# EAGLE schematic Sensor Board B (EAGLE 8.3.2)
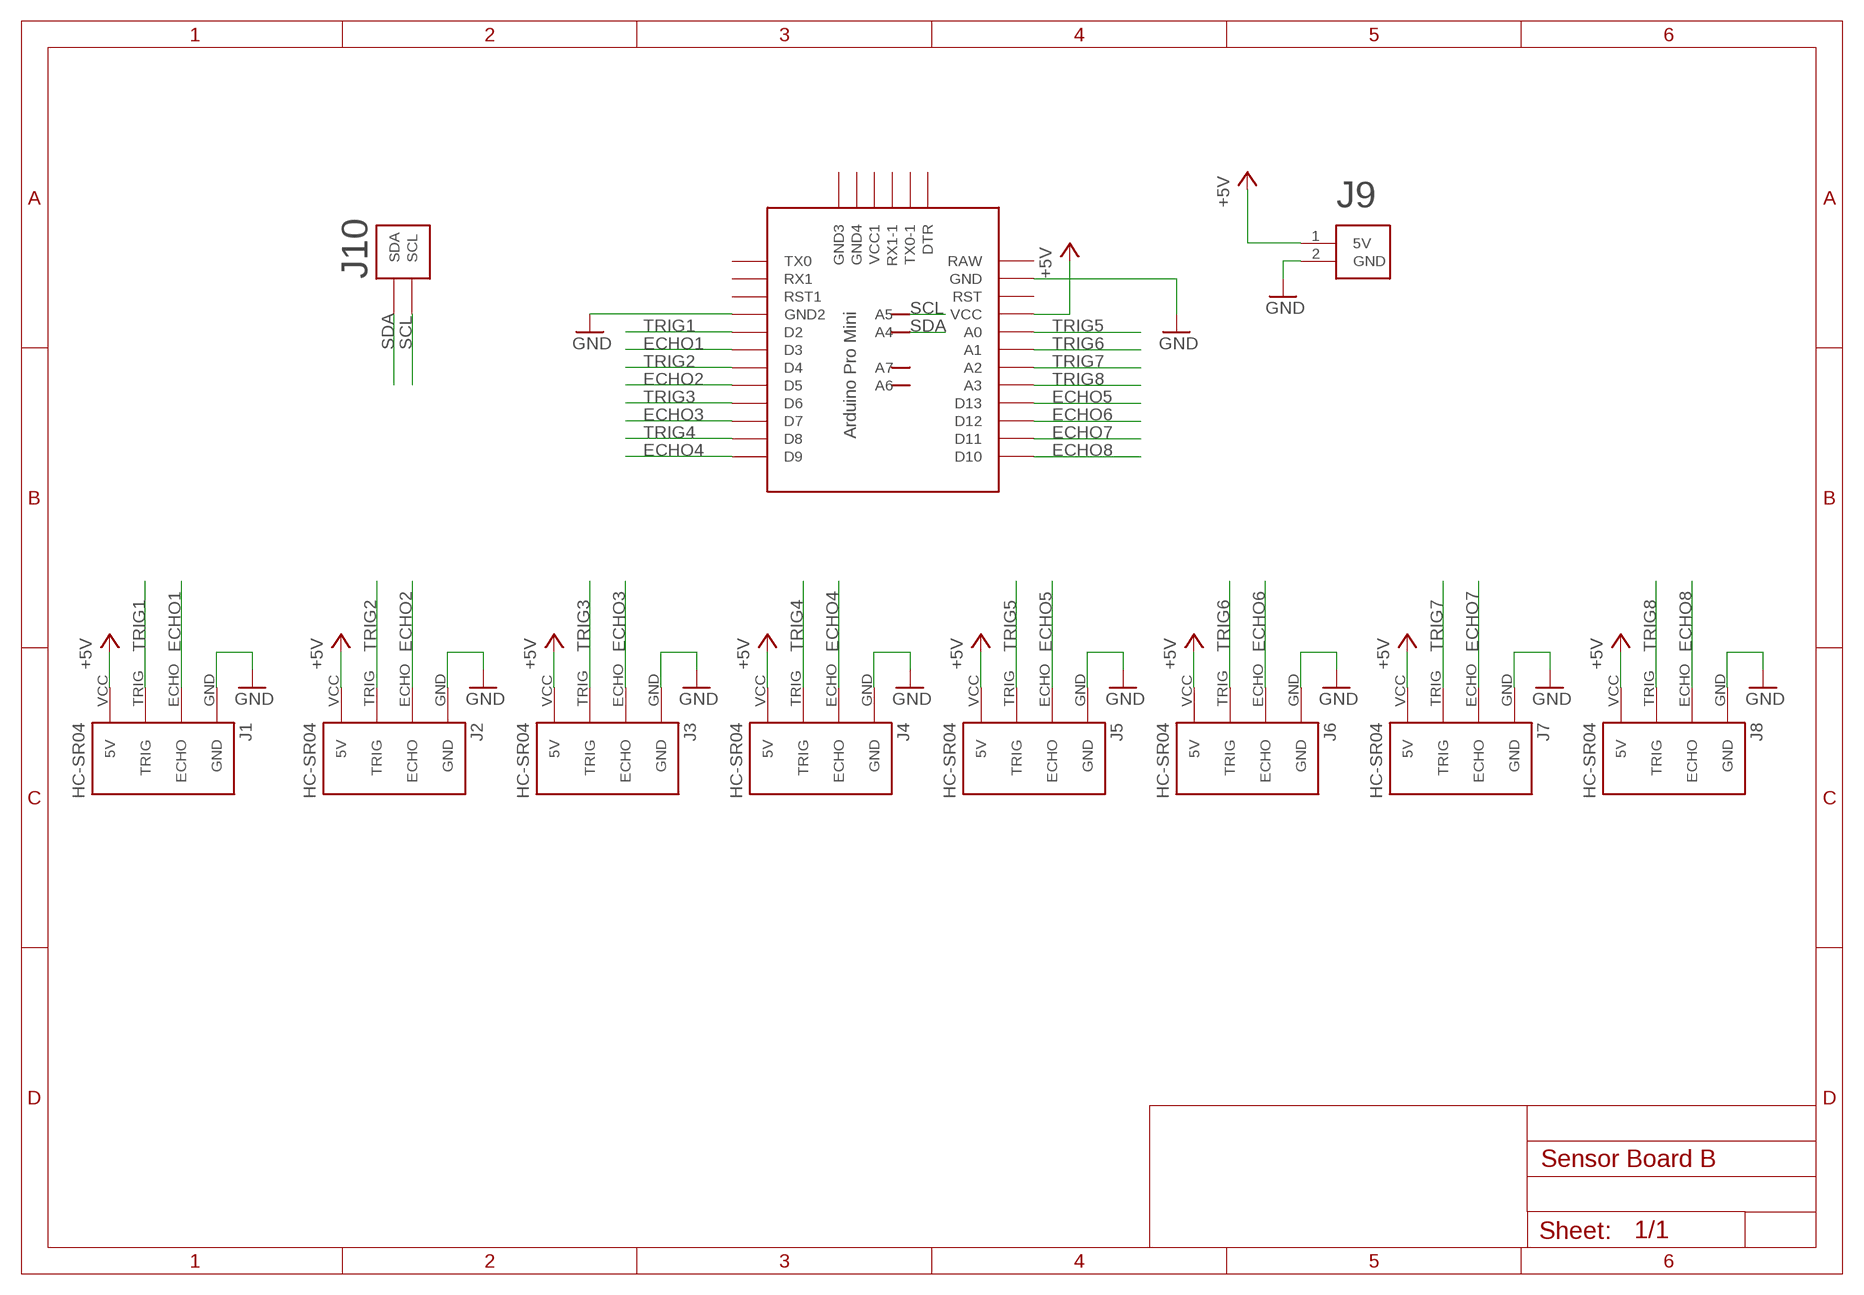
[diagram p0: schematic, sheet 1]

## Parts
J1  HC-SR04  [HC-SR04_FOOTPRINT]
J2  HC-SR04  [HC-SR04_FOOTPRINT]
J3  HC-SR04  [HC-SR04_FOOTPRINT]
J4  HC-SR04  [HC-SR04_FOOTPRINT]
J5  HC-SR04  [HC-SR04_FOOTPRINT]
J6  HC-SR04  [HC-SR04_FOOTPRINT]
J7  HC-SR04  [HC-SR04_FOOTPRINT]
J8  HC-SR04  [HC-SR04_FOOTPRINT]
J9  POWER_CONNECTOR  [XH_CONNECTOR]
J10  I2C_CONNECTOR  [XH_CONNECTOR]
U1  PRO-MINI-2  [PRO-MINI-2]

## Nets
+5V: J1.VCC(5V) J2.VCC(5V) J3.VCC(5V) J4.VCC(5V) J5.VCC(5V) J6.VCC(5V) J7.VCC(5V) J8.VCC(5V) J9.1(5V) U1.VCC
ECHO1: J1.ECHO U1.D3
ECHO2: J2.ECHO U1.D5
ECHO3: J3.ECHO U1.D7
ECHO4: J4.ECHO U1.D9
ECHO5: J5.ECHO U1.D13
ECHO6: J6.ECHO U1.D12
ECHO7: J7.ECHO U1.D11
ECHO8: J8.ECHO U1.D10
GND: J1.GND J2.GND J3.GND J4.GND J5.GND J6.GND J7.GND J8.GND J9.2(GND) U1.GND U1.GND1(GND2)
SCL: J10.1(SCL) U1.A5
SDA: J10.2(SDA) U1.A4
TRIG1: J1.TRIG U1.D2
TRIG2: J2.TRIG U1.D4
TRIG3: J3.TRIG U1.D6
TRIG4: J4.TRIG U1.D8
TRIG5: J5.TRIG U1.A0
TRIG6: J6.TRIG U1.A1
TRIG7: J7.TRIG U1.A2
TRIG8: J8.TRIG U1.A3
Unconnected: U1.A6 U1.A7 U1.DTR U1.GND2(GND3) U1.GND3(GND4) U1.RAW U1.RST U1.RST1 U1.RX1 U1.RX1-1 U1.TX0 U1.TX0-1 U1.VCC1

## Library data of the parts
J1-J8 = Ultrasonic Sensor HC-SR04:HC-SR04: Ultrasonic Sensor HC-SR04
J9 = thanics_robotics:POWER_CONNECTOR
J10 = thanics_robotics:I2C_CONNECTOR
U1 = Arduino-clone:PRO-MINI-2: Arduino Pro Mini Layout 2 Sparkfun.com